# Altium schematic sheet Archimedes_Cevirici_Kati.SchDoc: 5V Sağlanmasına Yönelik Alçaltıcı Çevirici Tasarımı
size A4; ApprovedBy: Emre Rasim; DrawnBy: Emre Rasim; DocumentNumber: 2; Revision: 1.3; SheetNumber: 5; SheetTotal: 8; Sematikicerigi: 5V Sağlanmasına Yönelik Alçaltıcı Tasarımı; Versiyon: 1.3
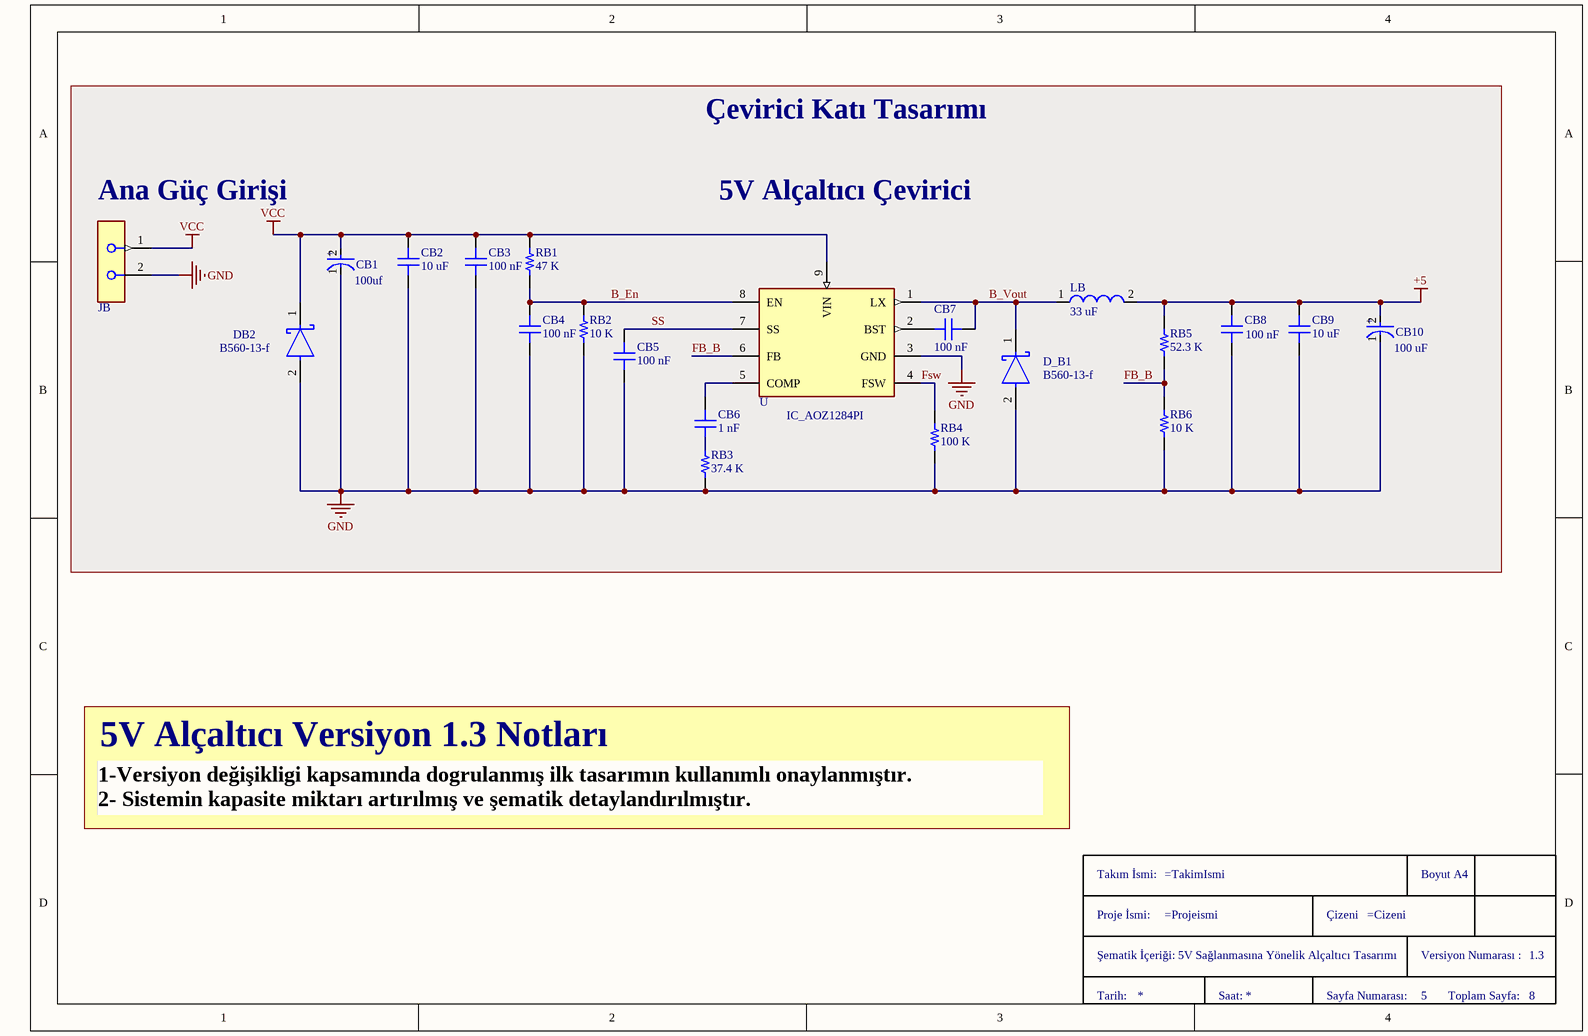
[diagram p0: Archimedes_Cevirici_Kati.SchDoc]

## Parts
CB1  100uf  [C_Smd_D6.3_H_7.7_Electrolytic_Cap]
CB2  10 uF  [CAP 1206/3216]
CB3  100 nF  [CAP 0805/2012]
CB4  100 nF  [CAP 0805/2012]
CB5  100 nF  [CAP 0805/2012]
CB6  1 nF  [CAP 0805/2012]
CB7  100 nF  [CAP 0805/2012]
CB8  100 nF  [CAP 0805/2012]
CB9  10 uF  [CAP 1206/3216]
CB10  100 uF  [C_Smd_D6.3_H_7.7_Electrolytic_Cap]
D_B1  B560-13-f  [D_DO214AB_B560C-13-F]
DB2  B560-13-f  [D_DO214AB_B560C-13-F]
JB  Con_5mm_2 lead  [Con_5mm_2lead]  (value not drawn)
LB  33 uF  [L_12*12_33uh_İnductor]
RB1  47 K  [RES 0805/2012]
RB2  10 K  [RES 0805/2012]
RB3  37.4 K  [RES 0805/2012]
RB4  100 K  [RES 0805/2012]
RB5  52.3 K  [RES 0805/2012]
RB6  10 K  [RES 0805/2012]
TitleBlock-A4  TitleBlock-A4  (value not drawn)  (graphical)
U  IC_AOZ1284PI  [IC_AOZ1284_SOP127P]

## Nets
+5: CB8.2 CB9.1 CB10.2(A) LB.2 RB5.2
GND: CB1.1(C) CB2.2 CB3.1 CB4.1 CB5.1 CB8.1 CB9.2 CB10.1(C) D_B1.2(A) DB2.2(A) JB.2 RB2.1 RB3.1 RB4.1 RB6.1 U.3(GND)
VCC: CB1.2(A) CB2.1 CB3.2 DB2.1(C) JB.1 RB1.2 U.9(VIN)
B_En: CB4.2 RB1.1 RB2.2 U.8(EN)
B_Vout: CB7.1 D_B1.1(C) LB.1 U.1(LX)
FB_B: RB5.1 RB6.2 U.6(FB)
Fsw: RB4.2 U.4(FSW)
SS: CB5.2 U.7(SS)
NetCB6_1: CB6.1 RB3.2
NetCB6_2: CB6.2 U.5(COMP)
NetCB7_2: CB7.2 U.2(BST)

## Notes on the sheet
- Çevirici Katı Tasarımı
- Ana Güç Girişi
- 5V Alçaltıcı Çevirici
- 5V Alçaltıcı Versiyon 1.3 Notları
- 1-Versiyon değişikligi kapsamında dogrulanmış ilk tasarımın kullanımlı onaylanmıştır.                          2- Sistemin kapasite miktarı artırılmış ve şematik detaylandırılmıştır.
- (in symbol C_smd_D6.3_H7.7) +
- (in symbol TitleBlock-A4) Takım İsmi:; Boyut A4; Proje İsmi:; Çizeni; Şematik İçeriği:; Versiyon Numarası :; Tarih:; Saat:; Sayfa Numarası:; Toplam Sayfa:

## Library data of the parts
CB1 CB10 = C_smd_D6.3_H7.7: Electrolytic capacitor with 100 uf and 35 volt rating
CB2 = Capacitor 1206: 10 uF  and 50 Volt Ceramic Capacitor 1206 pack with X5R rating
CB3 CB4 CB7 CB8 = Capacitor 805: 100 nF  and 50 Volt Ceramic Capacitor 805 pack with X7R rating
CB5 = Capacitor 805: 100 nF and 50 Volt Ceramic Capacitor 805 pack with X7R rating
CB6 = Capacitor 805: 1 nF and 50 Volt Ceramic Capacitor 805 pack with X7R rating
CB9 = Capacitor 1206: 10 uF  and 50 V Ceramic Capacitor 1206 pack with X5R rating
D_B1 DB2 = D_Do214AB_B560-13-F: Schottky diode with 5A and 60 Volt rating
JB = Con_5mm_2 lead: TERM BLOCK 2POS SIDE ENTRY 5MM
LB = L_12_12_33uh_smd_inductor: SMD Flat Wire High Current Inductor WE-HCI, L=33.0 µH; PartNumber: 74435573300; Inductance: 33.0 ÂµH; ComponentLink1Description: Manufacturer Link; ComponentLink2Description: Datasheet; DatasheetVersion: ver 2, Nov-2009; ComponentLink1URL: http://www.we-online.com; PackageVersion: 2009; PackageDescription: Inductor, 2-Leads, Body 18.3 x 18.2 mm; ComponentLink2URL: http://www.we-online.de/katalog/media/pdf/74435573300.pdf; PackageReference: WE-HCI-1890
RB1 = Resistor 805: 47 K ohm Resistor  with 805 pack and %1 tolerance rating
RB2 RB6 = Resistor 805: 10 K ohm Resistor  with 805 pack and %1 tolerance rating
RB3 = Resistor 805: 37,4 K ohm Resistor  with 805 pack and %1 tolerance rating
RB4 = Resistor 805: 100 K ohm Resistor  with 805 pack and %1 tolerance rating
RB5 = Resistor 805: 52,3 K ohm Resistor  with 805 pack and %1 tolerance rating
TitleBlock-A4 = TitleBlock-A4: Title Block for İTU eklemeli imalat takımı
U = IC_AOZ1284PI: Buck Switching Regulator IC Positive Adjustable 0.8V 1 Output 4A 8-SOIC _0.154, 3.90mm Width_ Exposed Pad; MF: Alpha &; Price: None; Availability: Unavailable; Package: SO-8 Alpha &amp; Omega Semiconductor; SnapEDA_Link: https://www.snapeda.com/parts/AOZ1284PI/Alpha%20%26%20Omega%20Semiconductor%20Inc./view-part/473739/?ref=snap; MP: AOZ1284PI; Value: *